# Altium schematic sheet [03] Motor Driver.SchDoc
size B; Organization: Altium Limited; Address1: L3, 12a Rodborough Rd; Address2: Frenchs Forest; Address3: NSW; Address4: Australia 2086
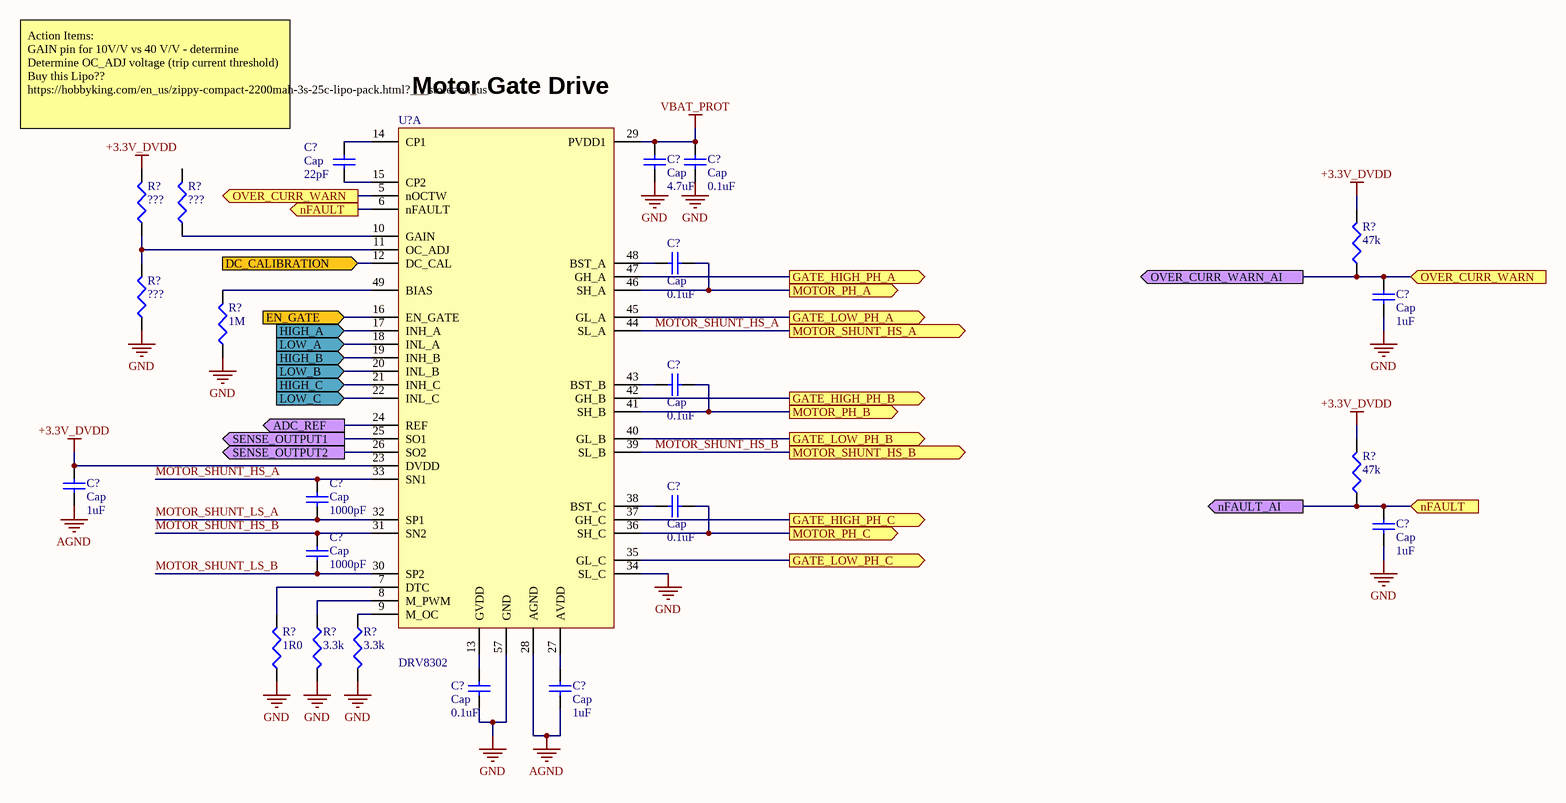
[diagram p0: [03] Motor Driver.SchDoc]

## Parts
(Parts that share a designator on the sheet are numbered #1, #2 ... from top to bottom, then left to right.)
C?#1  Cap  value 22pF  [RAD-0.3]
C?#2  Cap  value 4.7uF  [RAD-0.3]
C?#3  Cap  value 0.1uF  [RAD-0.3]
C?#4  Cap  value 0.1uF  [RAD-0.3]
C?#5  Cap  value 1uF  [RAD-0.3]
C?#6  Cap  value 0.1uF  [RAD-0.3]
C?#7  Cap  value 1uF  [RAD-0.3]
C?#8  Cap  value 0.1uF  [RAD-0.3]
C?#9  Cap  value 1000pF  [RAD-0.3]
C?#10  Cap  value 1uF  [RAD-0.3]
C?#11  Cap  value 1000pF  [RAD-0.3]
C?#12  Cap  value 0.1uF  [RAD-0.3]
C?#13  Cap  value 1uF  [RAD-0.3]
R?#1  ???  [0603_CAP]
R?#2  ???  [0603_CAP]
R?#3  47k  [0603_CAP]
R?#4  ???  [0603_CAP]
R?#5  1M  [0603_CAP]
R?#6  47k  [0603_CAP]
R?#7  3.3k  [0603_CAP]
R?#8  3.3k  [0603_CAP]
R?#9  1R0  [0603_CAP]
U?  DRV8302  (part A of 2)

## Ports
ADC_REF (out), DC_CALIBRATION (in), EN_GATE (in), GATE_HIGH_PH_A (out), GATE_HIGH_PH_B (out), GATE_HIGH_PH_C (out), GATE_LOW_PH_A (out), GATE_LOW_PH_B (out), GATE_LOW_PH_C (out), HIGH_A (in), HIGH_B (in), HIGH_C (in), LOW_A (in), LOW_B (in), LOW_C (in), MOTOR_PH_A (out), MOTOR_PH_B (out), MOTOR_PH_C (out), MOTOR_SHUNT_HS_A (out), MOTOR_SHUNT_HS_B (out), nFAULT (in), nFAULT (out), nFAULT_AI (out), OVER_CURR_WARN (in), OVER_CURR_WARN (out), OVER_CURR_WARN_AI (out), SENSE_OUTPUT1 (out), SENSE_OUTPUT2 (out)

## Nets
+3.3V_DVDD: C?#7.2 R?#1.2 R?#3.2 R?#6.2 U?.23(DVDD)
AGND: C?#7.1 C?#13.1 U?.28(AGND)
GND: C?#2.1 C?#3.1 C?#5.1 C?#10.1 C?#12.1 R?#4.1 R?#5.1 R?#7.2 R?#8.2 R?#9.1 U?.34(SL_C) U?.57(GND)
VBAT_PROT: C?#2.2 C?#3.2 U?.29(PVDD1)
ADC_REF: U?.24(REF) ; port ADC_REF
DC_CALIBRATION: U?.12(DC_CAL) ; port DC_CALIBRATION
EN_GATE: U?.16(EN_GATE) ; port EN_GATE
GATE_HIGH_PH_A: U?.47(GH_A) ; port GATE_HIGH_PH_A
GATE_HIGH_PH_B: U?.42(GH_B) ; port GATE_HIGH_PH_B
GATE_HIGH_PH_C: U?.37(GH_C) ; port GATE_HIGH_PH_C
GATE_LOW_PH_A: U?.45(GL_A) ; port GATE_LOW_PH_A
GATE_LOW_PH_B: U?.40(GL_B) ; port GATE_LOW_PH_B
GATE_LOW_PH_C: U?.35(GL_C) ; port GATE_LOW_PH_C
HIGH_A: U?.17(INH_A) ; port HIGH_A
HIGH_B: U?.19(INH_B) ; port HIGH_B
HIGH_C: U?.21(INH_C) ; port HIGH_C
LOW_A: U?.18(INL_A) ; port LOW_A
LOW_B: U?.20(INL_B) ; port LOW_B
LOW_C: U?.22(INL_C) ; port LOW_C
MOTOR_PH_A: C?#4.2 U?.46(SH_A) ; port MOTOR_PH_A
MOTOR_PH_B: C?#6.2 U?.41(SH_B) ; port MOTOR_PH_B
MOTOR_PH_C: C?#8.2 U?.36(SH_C) ; port MOTOR_PH_C
MOTOR_SHUNT_HS_A: C?#9.2 U?.33(SN1) U?.44(SL_A) ; port MOTOR_SHUNT_HS_A
MOTOR_SHUNT_HS_B: C?#11.2 U?.31(SN2) U?.39(SL_B) ; port MOTOR_SHUNT_HS_B
MOTOR_SHUNT_LS_A: C?#9.1 U?.32(SP1)
MOTOR_SHUNT_LS_B: C?#11.1 U?.30(SP2)
nFAULT: C?#10.2 R?#6.1 U?.6(nFAULT) ; port nFAULT, port nFAULT_AI
OVER_CURR_WARN: C?#5.2 R?#3.1 U?.5(nOCTW) ; port OVER_CURR_WARN, port OVER_CURR_WARN_AI
SENSE_OUTPUT1: U?.25(SO1) ; port SENSE_OUTPUT1
SENSE_OUTPUT2: U?.26(SO2) ; port SENSE_OUTPUT2
NetC?#1_1: C?#1.1 U?.15(CP2)
NetC?#1_2: C?#1.2 U?.14(CP1)
NetC?#4_1: C?#4.1 U?.48(BST_A)
NetC?#6_1: C?#6.1 U?.43(BST_B)
NetC?#8_1: C?#8.1 U?.38(BST_C)
NetC?#12_2: C?#12.2 U?.13(GVDD)
NetC?#13_2: C?#13.2 U?.27(AVDD)
NetR?#1_1: R?#1.1 R?#4.2 U?.11(OC_ADJ)
NetR?#2_1: R?#2.1 U?.10(GAIN)
NetR?#5_2: R?#5.2 U?.49(BIAS)
NetR?#7_1: R?#7.1 U?.8(M_PWM)
NetR?#8_1: R?#8.1 U?.9(M_OC)
NetR?#9_2: R?#9.2 U?.7(DTC)

Not connected (* = marked no-connect by the designer): R?#2 2

## Notes on the sheet
- Action Items:
  GAIN pin for 10V/V vs 40 V/V - determine
  Determine OC_ADJ voltage (trip current threshold)
  Buy this Lipo?? https://hobbyking.com/en_us/zippy-compact-2200mah-3s-25c-lipo-pack.html?___store=en_us
- (near U?) Motor Gate Drive
- Title
- Size:
- Date:
- B
- Number:
- Time:
- Revision:
- Sheet
- of
- File:

## Library data of the parts
C?#1-C?#13 = Cap: Capacitor; Published: 8-Jun-2000; LatestRevisionDate: 17-Jul-2002; LatestRevisionNote: Re-released for DXP Platform.; PackageReference: RAD-0.3; Publisher: Altium Limited; PackageDescription: Radial Cap, Thru-Hole; 2 Leads; 0.3 in Pin Spacing
R?#1-R?#9 = RC0603FR-073K3L: RES SMD 3.3K OHM 1% 1/10W 0603; Manufacturer 1: Yageo; Category 1: Resistors; Power (Watts): 0.1W, 1/10W; Temperature Coefficient: ±100ppm/°C; Supplier 1: Digi-Key; Manufacturer Part Number 1: RC0603FR-073K3L; RoHS: RoHS Compliant; Description 1: RES SMD 3.3K OHM 1% 1/10W 0603; Stock 1: 668905; Pricing 1: 1=0.1, 10=0.014, 25=0.01, 100=0.0057, 250=0.00436, 500=0.00348, 1000=0.00257, 2500=0.00223 (USD); Packaging: Cut Tape (CT); Resistance (Ohms): 3.3k; Tolerance: ±1%; Composition: Thick Film; Features: Moisture Resistant; Operating Temperature: -55°C ~ 155°C; Package / Case: 0603 (1608 Metric); Supplier Device Package: 0603; Size / Dimension: 0.063" L x 0.031" W (1.60mm x 0.80mm); Height: 0.022" (0.55mm); Number of Terminations: 2; ComponentLink1URL: http://www.yageo.com/documents/recent/PYu-RC_Group_51_RoHS_L_04.pdf; ComponentLink1Description: http://www.yageo.com/documents/recent/PYu-RC_Group_51_RoHS_L_04.pdf; Supplier Part Number 1: 311-3.30KHRCT-ND
U? = DRV8302DCAR: IC MOTOR CONTROLLER PAR 56HTSSOP; Manufacturer 1: Texas Instruments; Category 1: Integrated Circuits (ICs); Motor Type - AC, DC: Brushless DC (BLDC); Function: Controller - Commutation, Direction Management; Output Configuration: Pre-Driver - Half Bridge (3); Interface: Parallel; Voltage - Supply: 8 V ~ 60 V; Supplier 1: Digi-Key; Manufacturer Part Number 1: DRV8302DCAR; RoHS: RoHS Compliant; Description 1: IC MOTOR CONTROLLER PAR 56HTSSOP; Stock 1: 3089; Pricing 1: 1=6.14, 10=5.516, 100=4.5191, 500=3.84706, 1000=3.2445 (USD); Packaging: Cut Tape (CT); Part Status: Active; Motor Type - Stepper: -; Technology: Power MOSFET; Step Resolution: -; Applications: General Purpose; Current - Output: -; Voltage - Load: -; Operating Temperature: -40°C ~ 125°C (TA); Mounting Type: Surface Mount; Package / Case: 56-TFSOP (0.240", 6.10mm Width) Exposed Pad; Supplier Device Package: 56-HTSSOP; ComponentLink1URL: http://www.ti.com/lit/ds/symlink/drv8302.pdf; ComponentLink1Description: http://www.ti.com/lit/ds/symlink/drv8302.pdf; Supplier Part Number 1: 296-29544-1-ND